# EAGLE design Mouse Version 2 (EAGLE 9.5.1)
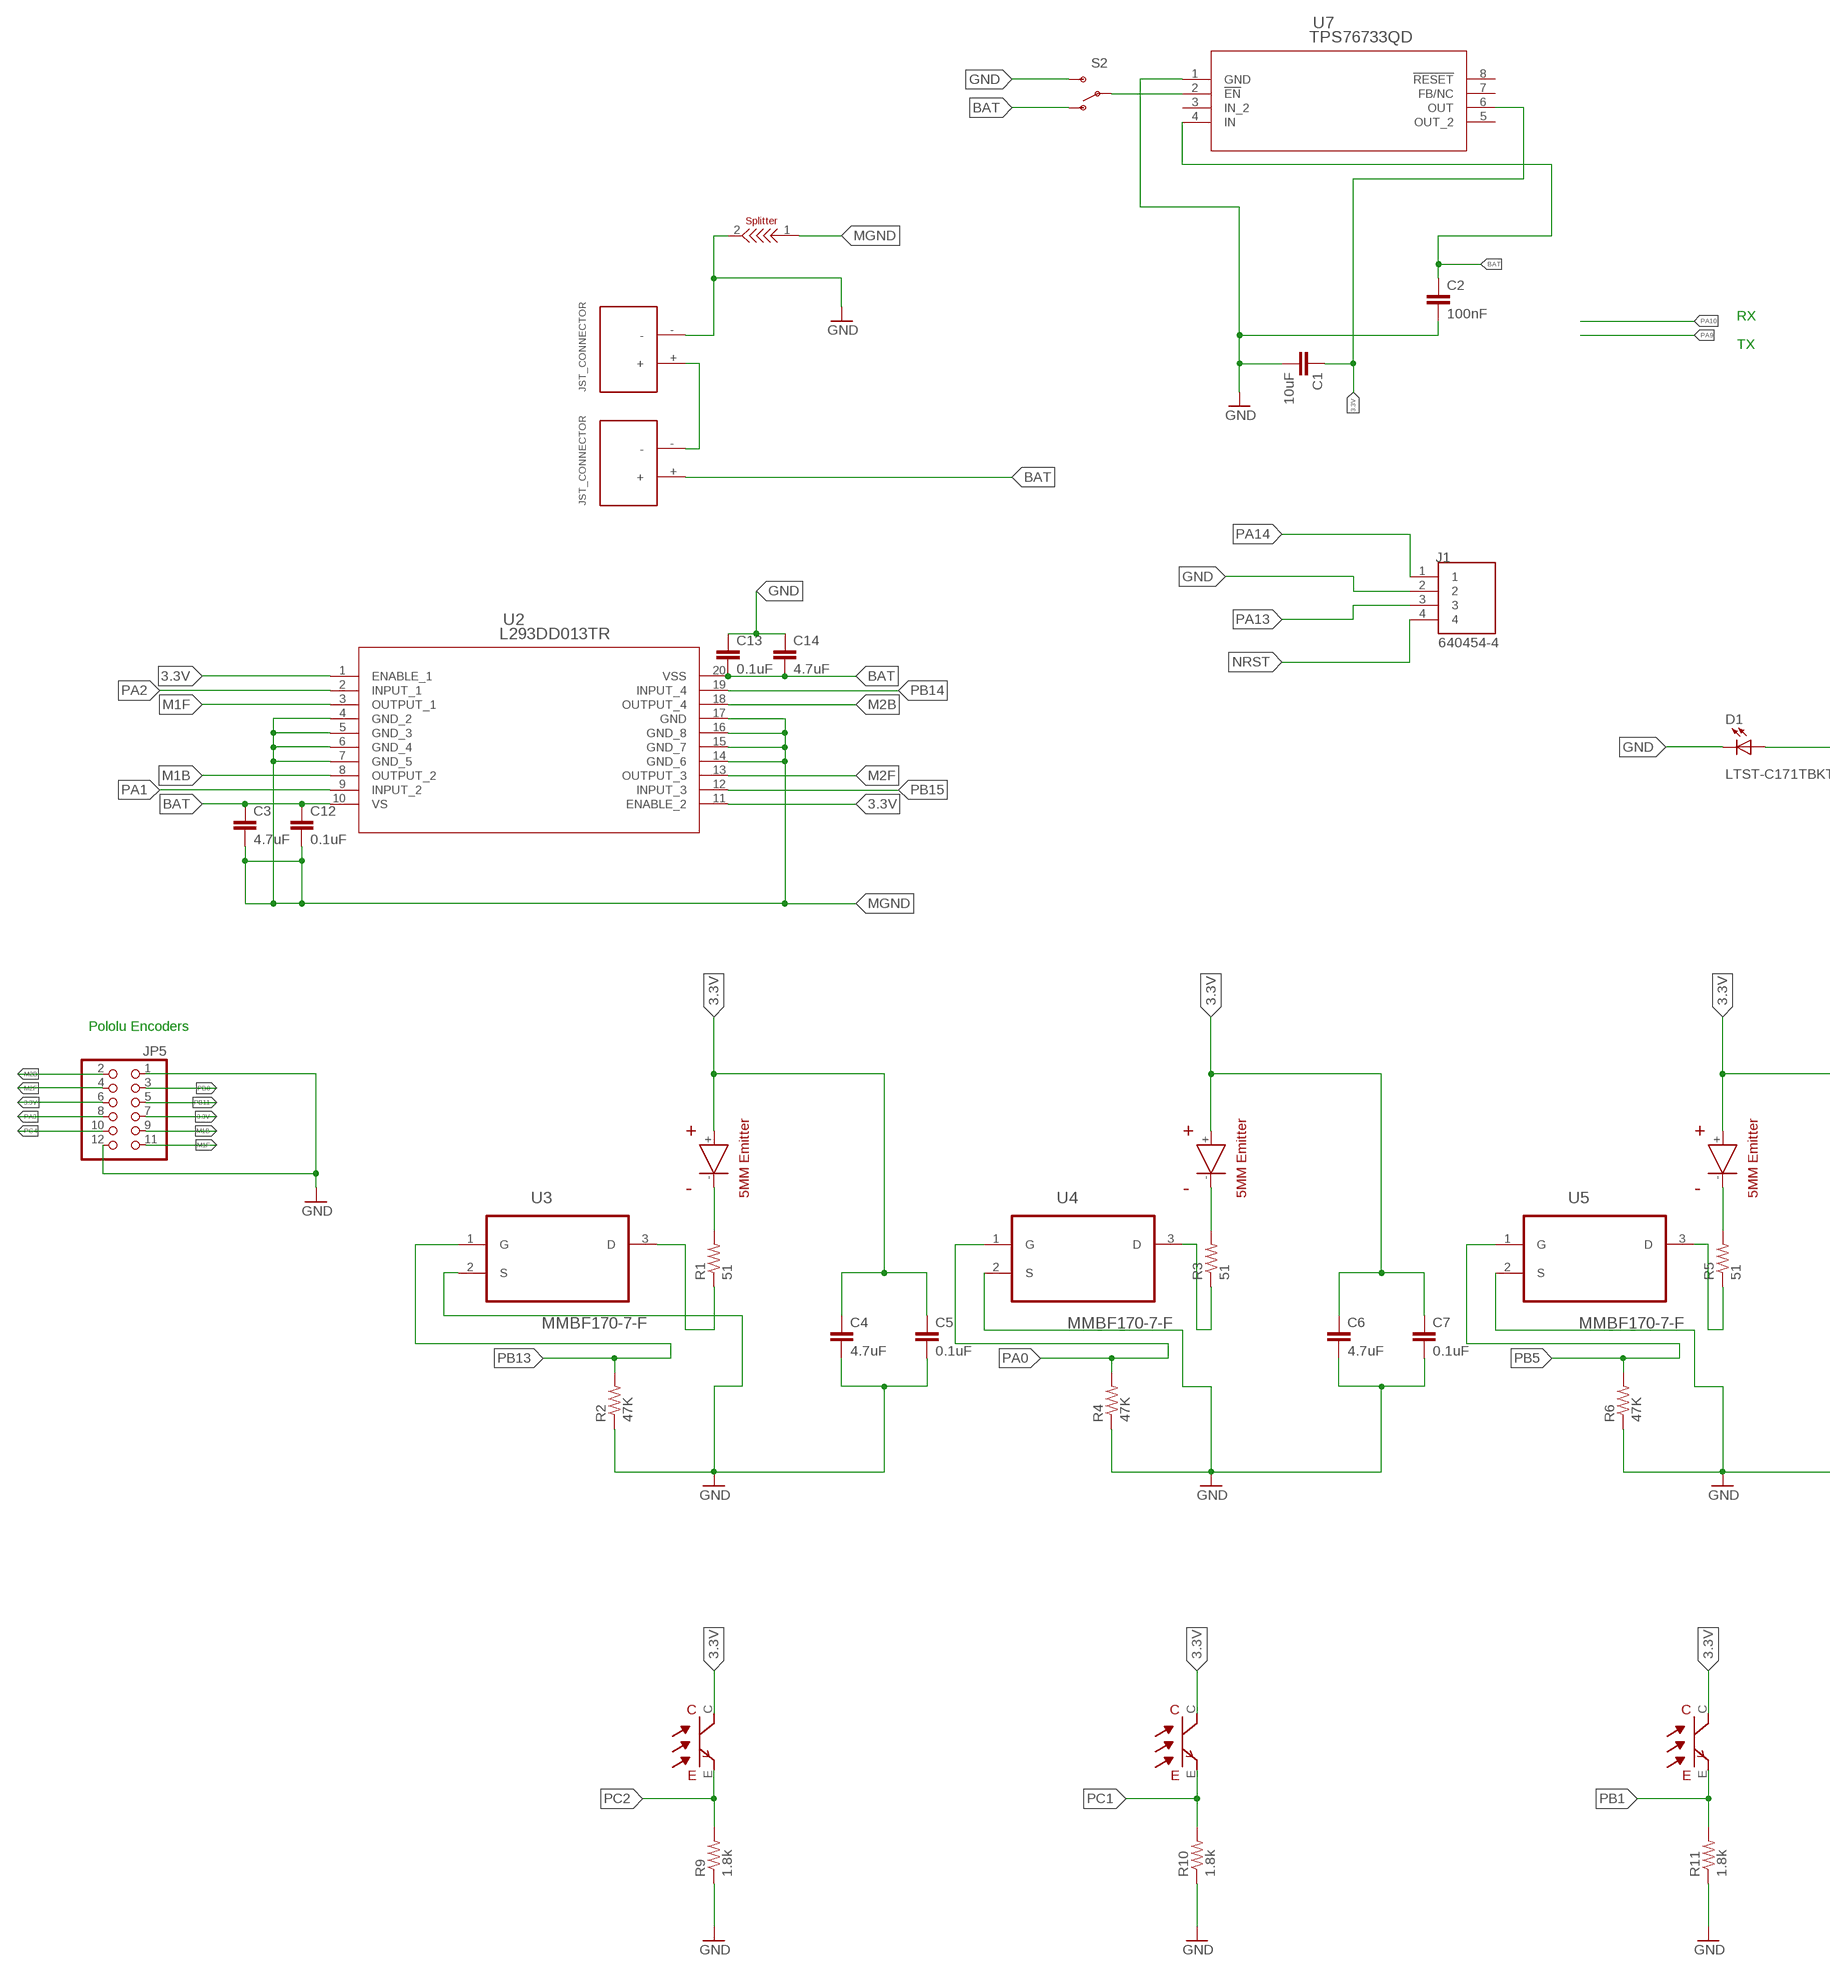
[diagram p0: schematic, sheet 1, part 1 of 2]
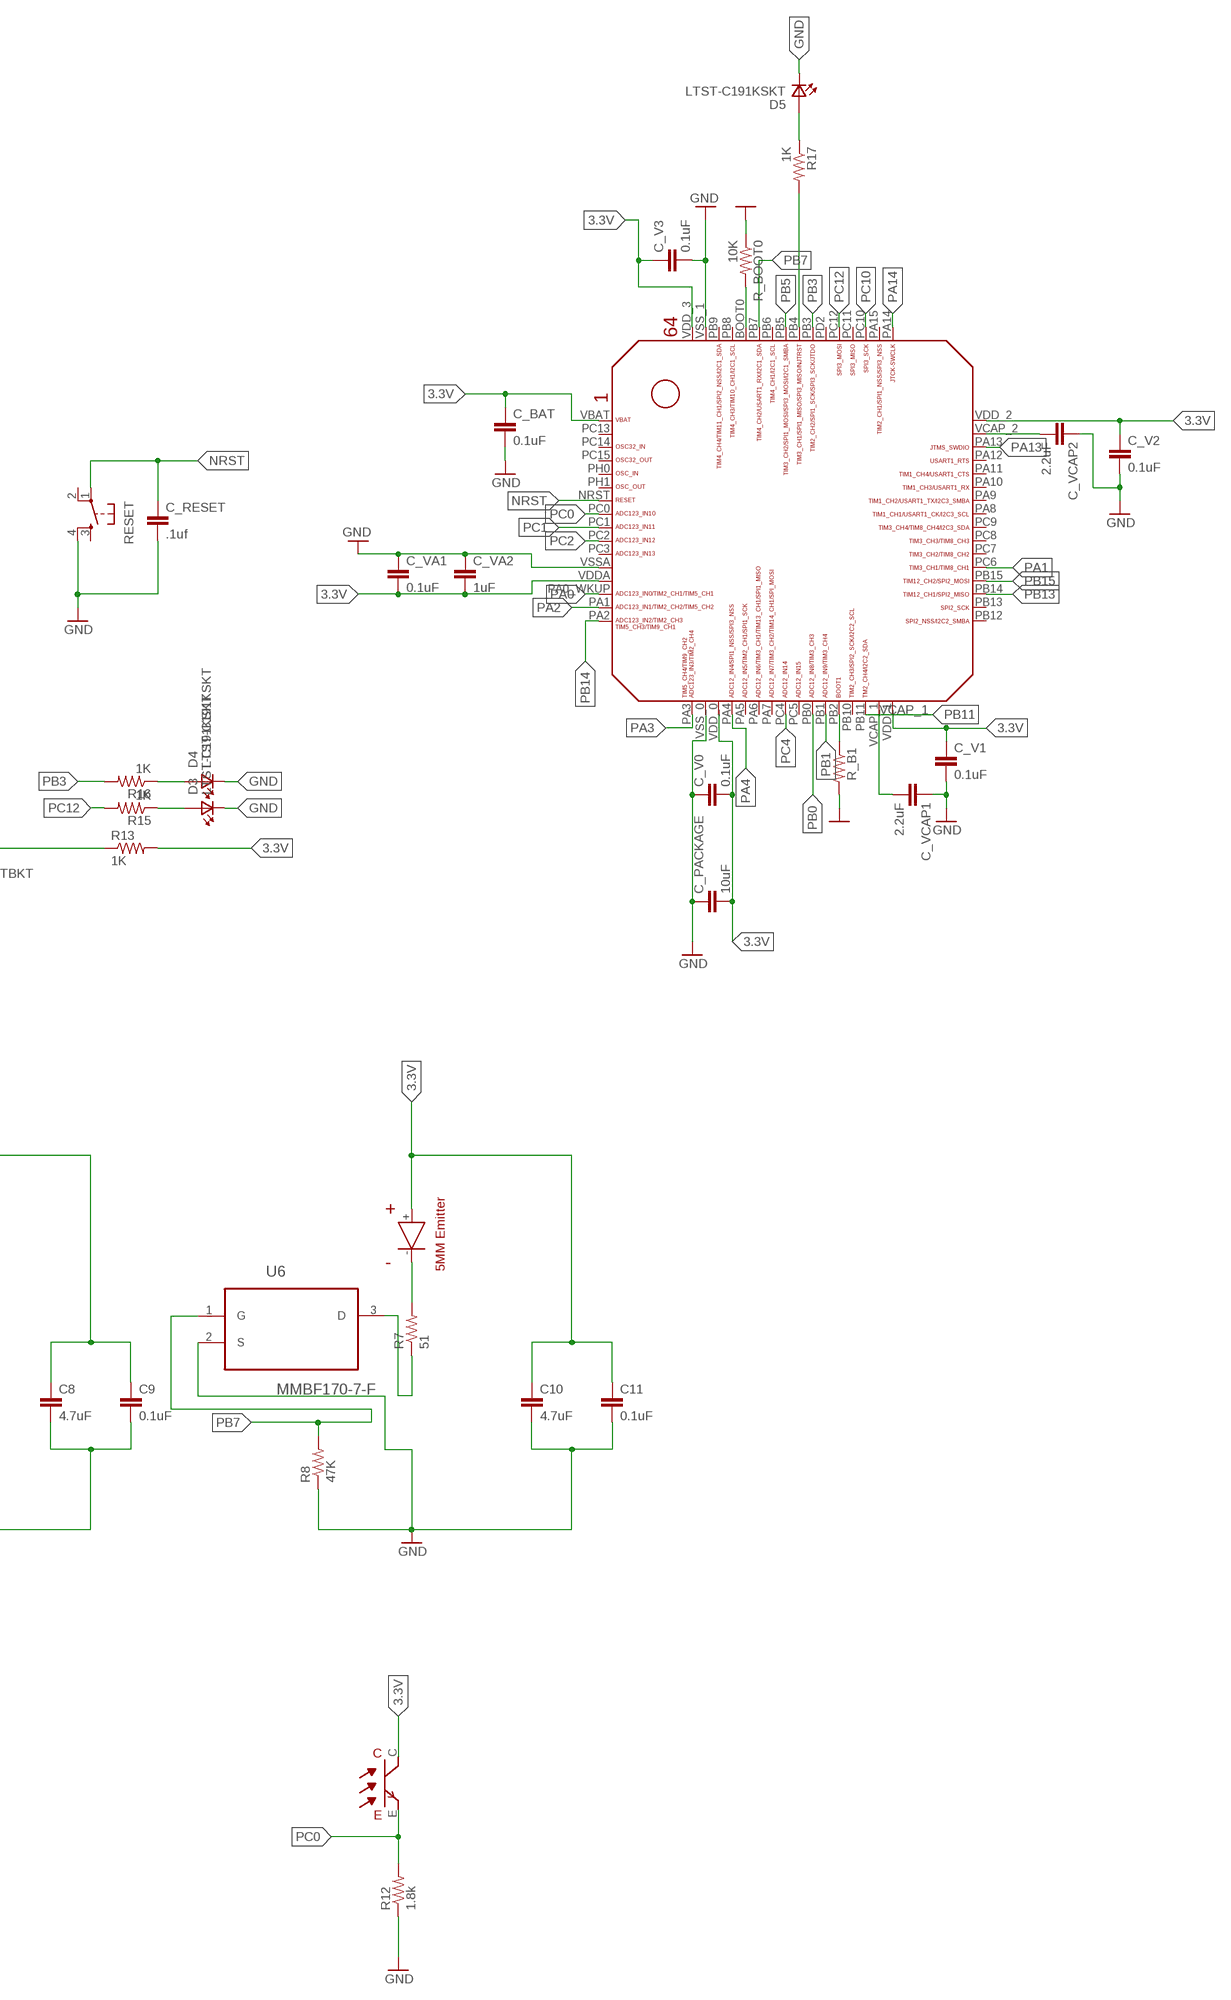
[diagram p1: schematic, sheet 1, part 2 of 2]

## Parts
C1  10uF  CAP0603-CAP  [0603-CAP]
C2  100nF  CAP0603-CAP  [0603-CAP]
C3  4.7uF  CAP0603-CAP  [0603-CAP]
C4  4.7uF  C-EUC1206  [C1206]
C5  0.1uF  C-EUC1206  [C1206]
C6  4.7uF  C-EUC1206  [C1206]
C7  0.1uF  C-EUC1206  [C1206]
C8  4.7uF  C-EUC1206  [C1206]
C9  0.1uF  C-EUC1206  [C1206]
C10  4.7uF  C-EUC1206  [C1206]
C11  0.1uF  C-EUC1206  [C1206]
C12  0.1uF  CAP0603-CAP  [0603-CAP]
C13  0.1uF  CAP0603-CAP  [0603-CAP]
C14  4.7uF  CAP0603-CAP  [0603-CAP]
C_BAT  0.1uF  CAP0603-CAP  [0603-CAP]
C_PACKAGE  10uF  CAP0603-CAP  [0603-CAP]
C_RESET  .1uf  10NF-0603-50V-10%  [0603]
C_V0  0.1uF  CAP0603-CAP  [0603-CAP]
C_V1  0.1uF  CAP0603-CAP  [0603-CAP]
C_V2  0.1uF  CAP0603-CAP  [0603-CAP]
C_V3  0.1uF  CAP0603-CAP  [0603-CAP]
C_VA1  0.1uF  CAP0603-CAP  [0603-CAP]
C_VA2  1uF  CAP0603-CAP  [0603-CAP]
C_VCAP1  2.2uF  CAP0603-CAP  [0603-CAP]
C_VCAP2  2.2uF  CAP0603-CAP  [0603-CAP]
D1  LTST-C171TBKT  [DIOC200X125X110]
D3  LTST-C191KSKT  [0603]
D4  LTST-C191KSKT  [0603]
D5  LTST-C191KSKT  [0603]
J1  640454-4  [TE_640454-4]
JP5  PINHD-2X6  [2X06]
R1  51  R-US_R0603  [R0603]
R2  47K  R-US_R0603  [R0603]
R3  51  R-US_R0603  [R0603]
R4  47K  R-US_R0603  [R0603]
R5  51  R-US_R0603  [R0603]
R6  47K  R-US_R0603  [R0603]
R7  51  R-US_R0603  [R0603]
R8  47K  R-US_R0603  [R0603]
R9  1.8k  R-US_R0603  [R0603]
R10  1.8k  R-US_R0603  [R0603]
R11  1.8k  R-US_R0603  [R0603]
R12  1.8k  R-US_R0603  [R0603]
R13  1K  R-US_R0603  [R0603]
R15  1K  R-US_R0603  [R0603]
R16  1K  R-US_R0603  [R0603]
R17  1K  R-US_R0603  [R0603]
R_B1  10K  RESISTOR0603  [0603-RES]
R_BOOT0  10K  RESISTOR0603  [0603-RES]
RESET  TAC_SWITCHPTH  [TACTILE-PTH]
S2  SWITCH-SPSTPTH  [SWITCH-SPDT]
U2  L293DD013TR  [SO-20]
U3  MMBF170-7-F  [SOT103P240X110-3N]
U4  MMBF170-7-F  [SOT103P240X110-3N]
U5  MMBF170-7-F  [SOT103P240X110-3N]
U6  MMBF170-7-F  [SOT103P240X110-3N]
U7  TPS76733QD  [D8]
U$1  JST_CONNECTOR_FEMALE  [JST_CONNECTOR_FEMALE]
U$2  JST_CONNECTOR_FEMALE  [JST_CONNECTOR_FEMALE]
U$3  SPLITTER  [SPLITTER]
U$4  RECEIVER  [RECEIVER]
U$5  EMITTER  [EMITTER]
U$6  EMITTER  [EMITTER]
U$7  EMITTER  [EMITTER]
U$8  EMITTER  [EMITTER]
U$9  STM32F405/415_LQFP64  [STM32F405/415_LQFP64]
U$15  RECEIVER  [RECEIVER]
U$18  RECEIVER  [RECEIVER]
U$19  RECEIVER  [RECEIVER]

## Nets
3.3V: C1.1 C4.1 C5.1 C6.1 C7.1 C8.1 C9.1 C10.1 C11.1 C_BAT.1 C_PACKAGE.2 C_V0.2 C_V1.1 C_V2.1 C_V3.1 C_VA1.2 C_VA2.2 JP5.6 JP5.7 R13.2 U2.1(ENABLE_1) U2.11(ENABLE_2) U7.6(OUT) U$4.C U$5.+ U$6.+ U$7.+ U$8.+ U$9.VBAT U$9.VDD_0 U$9.VDD_1 U$9.VDD_2 U$9.VDD_3 U$9.VDDA U$15.C U$18.C U$19.C
BAT: C2.1 C3.1 C12.1 C13.2 C14.2 S2.1(O) U2.10(VS) U2.20(VSS) U7.4(IN) U$2.+
BOOT0: R_BOOT0.2 U$9.BOOT0
GND: C1.2 C2.2 C4.2 C5.2 C6.2 C7.2 C8.2 C9.2 C10.2 C11.2 C13.1 C14.1 C_BAT.2 C_PACKAGE.1 C_RESET.2 C_V0.1 C_V1.2 C_V2.2 C_V3.2 C_VA1.1 C_VA2.1 C_VCAP1.1 C_VCAP2.1 D1.- D3.1(K2) D4.1(K2) D5.1(K2) J1.2 JP5.1 JP5.12 R2.1 R4.1 R6.1 R8.1 R9.1 R10.1 R11.1 R12.1 R_B1.2 R_BOOT0.1 RESET.4 S2.3(S) U3.2(S) U4.2(S) U5.2(S) U6.2(S) U7.1(GND) U$1.- U$3.2 U$9.VSS_0 U$9.VSS_1 U$9.VSSA
M1B: JP5.9 U2.8(OUTPUT_2)
M1F: JP5.11 U2.3(OUTPUT_1)
M2B: JP5.2 U2.18(OUTPUT_4)
M2F: JP5.4 U2.13(OUTPUT_3)
MGND: C3.2 C12.2 U2.4(GND_2) U2.5(GND_3) U2.6(GND_4) U2.7(GND_5) U2.14(GND_6) U2.15(GND_7) U2.16(GND_8) U2.17(GND) U$3.1
N$1: U$1.+ U$2.-
N$2: R3.2 U$6.-
N$3: S2.2(P) U7.2(!EN)
N$5: C_VCAP2.2 U$9.VCAP_2
N$6: R1.2 U$5.-
N$7: R1.1 U3.3(D)
N$9: D1.+ R13.1
N$10: R3.1 U4.3(D)
N$11: R5.2 U$7.-
N$12: R5.1 U5.3(D)
N$13: R7.2 U$8.-
N$14: R7.1 U6.3(D)
N$18: D3.2(A2) R15.1
N$20: D4.2(A2) R16.1
N$22: D5.2(A2) R17.1
NRST: C_RESET.1 J1.4 RESET.1 U$9.NRST
PA0: R4.2 U4.1(G) U$9.PA0_WKUP(PA0_AKUP)
PA1: U2.9(INPUT_2) U$9.PC6
PA2: U2.2(INPUT_1) U$9.PA1
PA3: JP5.8 U$9.PA3
PA4: U$9.PA4
PA13: J1.3 U$9.PA13
PA14: J1.1 U$9.PA14
PB0: JP5.3 U$9.PB0
PB1: R11.2 U$9.PB1 U$15.E
PB2: R_B1.1 U$9.PB2
PB3: R16.2 U$9.PB3
PB4: R17.2 U$9.PB4
PB5: R6.2 U5.1(G) U$9.PB5
PB7: R8.2 U6.1(G) U$9.PB7
PB11: JP5.5 U$9.PB11
PB13: R2.2 U3.1(G) U$9.PB14
PB14: U2.19(INPUT_4) U$9.PA2
PB15: U2.12(INPUT_3) U$9.PB15
PC0: R12.2 U$4.E U$9.PC0
PC1: R10.2 U$9.PC1 U$18.E
PC2: R9.2 U$9.PC2 U$19.E
PC4: JP5.10 U$9.PC4
PC10: U$9.PC10
PC12: R15.2 U$9.PC12
VCAP_1: C_VCAP1.2 U$9.VCAP_1
Unconnected: RESET.2 RESET.3 U7.3(IN_2) U7.5(OUT_2) U7.7(FB/NC) U7.8(!RESET) U$9.PA5 U$9.PA6 U$9.PA7 U$9.PA8 U$9.PA9 U$9.PA10 U$9.PA11 U$9.PA12 U$9.PA15 U$9.PB6 U$9.PB8 U$9.PB9 U$9.PB10 U$9.PB12 U$9.PB13 U$9.PC3 U$9.PC5 U$9.PC7 U$9.PC8 U$9.PC9 U$9.PC11 U$9.PC13 U$9.PC14 U$9.PC15 U$9.PD2 U$9.PH0 U$9.PH1

## Notes on the sheet
- RX
- TX
- Pololu Encoders

## Library data of the parts
C1-C3 C12-C14 C_BAT C_PACKAGE C_V0 C_V1-C_V3 C_VA1 C_VA2 C_VCAP1 C_VCAP2 = SparkFun:CAP: Capacitor Standard 0603 ceramic capacitor, and 0.1" leaded capacitor.
C4-C11 = rcl:C-EU: CAPACITOR, European symbol; SPICEPREFIX: C
C_RESET = SparkFun-Capacitors:10NF: 0.01uF/10nF/10,000pF ceramic capacitors A capacitor is a passive two-terminal electrical component used to store electrical energy temporarily in an electric field. CAP-09321; PROD_ID: CAP-00867; VALUE: 10nF
D1 = LTST-C171TBKT:LTST-C171TBKT: Green 2 x 1.25 x 1.1 mm 130° Water Clear 35 mcd 2 V Surface Mount LED; DESCRIPTION: Blue 470nm LED Indication - Discrete 3.3V 0805 _2012 Metric_; DIGI-KEY_PART_NUMBER: 160-1645-1-ND; DIGI-KEY_PURCHASE_URL: https://www.digikey.com/product-detail/en/lite-on-inc/LTST-C171TBKT/160-1645-1-ND/573585?utm_source=snapeda&utm_medium=aggregator&utm_campaign=symbol; MF: Lite-On Inc.; MP: LTST-C171TBKT; PACKAGE: 0805 Lite-On
D3-D5 = LTST-C191KSKT:LTST-C191KSKT: http://octopart.com/ltst-c190krkt-lite-on-549893; DESCRIPTION: Yellow 591nm LED Indication - Discrete 2.1V 0603 _1608 Metric_; DIGI-KEY_PART_NUMBER: 160-1448-1-ND; DIGI-KEY_PURCHASE_URL: https://www.digikey.com/product-detail/en/lite-on-inc/LTST-C191KSKT/160-1448-1-ND/386838?utm_source=snapeda&utm_medium=aggregator&utm_campaign=symbol; MF: Lite-On Inc.; MP: LTST-C191KSKT; PACKAGE: 0603 Lite-On
J1 = 640454-4:640454-4; CENTERLINE_PITCH: 2.54 mm[.1 in]; COMMENT: 640454-4; DESCRIPTION: 04P MTA100 HDR ASSY SQ STR POL; DIGI-KEY_PART_NUMBER: A19431-ND; DIGI-KEY_PURCHASE_URL: https://www.digikey.com/product-detail/en/te-connectivity-amp-connectors/640454-4/A19431-ND/258986?utm_source=snapeda&utm_medium=aggregator&utm_campaign=symbol; EU_ROHS_COMPLIANCE: Compliant; MF: TE Connectivity; MP: 640454-4; NUMBER_OF_POSITIONS: 4; PACKAGE: None; PRODUCT_TYPE: Connector; TE_PURCHASE_URL: https://www.te.com/usa-en/product-640454-4.html?te_bu=Cor&te_type=disp&te_campaign=seda_glo_cor-seda-global-disp-prtnr-fy19-seda-model-bom-cta_sma-317_1&elqCampaignId=32493
JP5 = pinhead:PINHD-2X6: PIN HEADER
R1-R13 R15-R17 = MM2019Libv3:R-US_: RESISTOR, American symbol; SPICEPREFIX: R
R_B1 R_BOOT0 = SparkFun-Resistors:RESISTOR: Resistor Basic schematic elements and footprints for 0603, 1206, and PTH resistors.
RESET = SparkFun-Retired:TAC_SWITCH: Momentary Switch Button commonly used for reset or general input. Spark Fun Electronics SKU : COM-00097 SMT- SWCH-08247
S2 = SparkFun:SWITCH-SPST: SPST Switch Simple slide switch. Spark Fun Electronics SKU : COM-00102
U2 = MM2019Libv3:L293DD013TR; BUILT_BY: EMA_UL_Team; MANUFACTURER_PART_NUMBER: L293DD013TR; VENDOR: STMicroelectronics
U3-U6 = MMBF170-7-F:MMBF170-7-F: N-CHANNEL ENHANCEMENT MODE FIELD EFFECT TRANSISTOR; AVAILABILITY: Unavailable; DESCRIPTION: N-Channel 60V 500mA _Ta_ 300mW _Ta_ Surface Mount SOT-23-3; MF: Diodes Inc.; MP: MMBF170-7-F; PACKAGE: SOT-23-3 Diodes Inc.; PRICE: None
U7 = QFN50P300X300X80-17N:TPS76733QD; BUILT_BY: EMA_UL_Team; MANUFACTURER_PART_NUMBER: TPS76733QD; VENDOR: Texas Instruments
U$1 U$2 = JST_CONNECTOR_FEMALE. through hole:JST_CONNECTOR_FEMALE
U$3 = splitter:SPLITTER
U$4 U$15 U$18 U$19 = sfh4550 _ teft4300:RECEIVER
U$5-U$8 = sfh4550 & teft4300:EMITTER
U$9 = STM32F10x F4xx:STM32F405/415_LQFP64

## Board
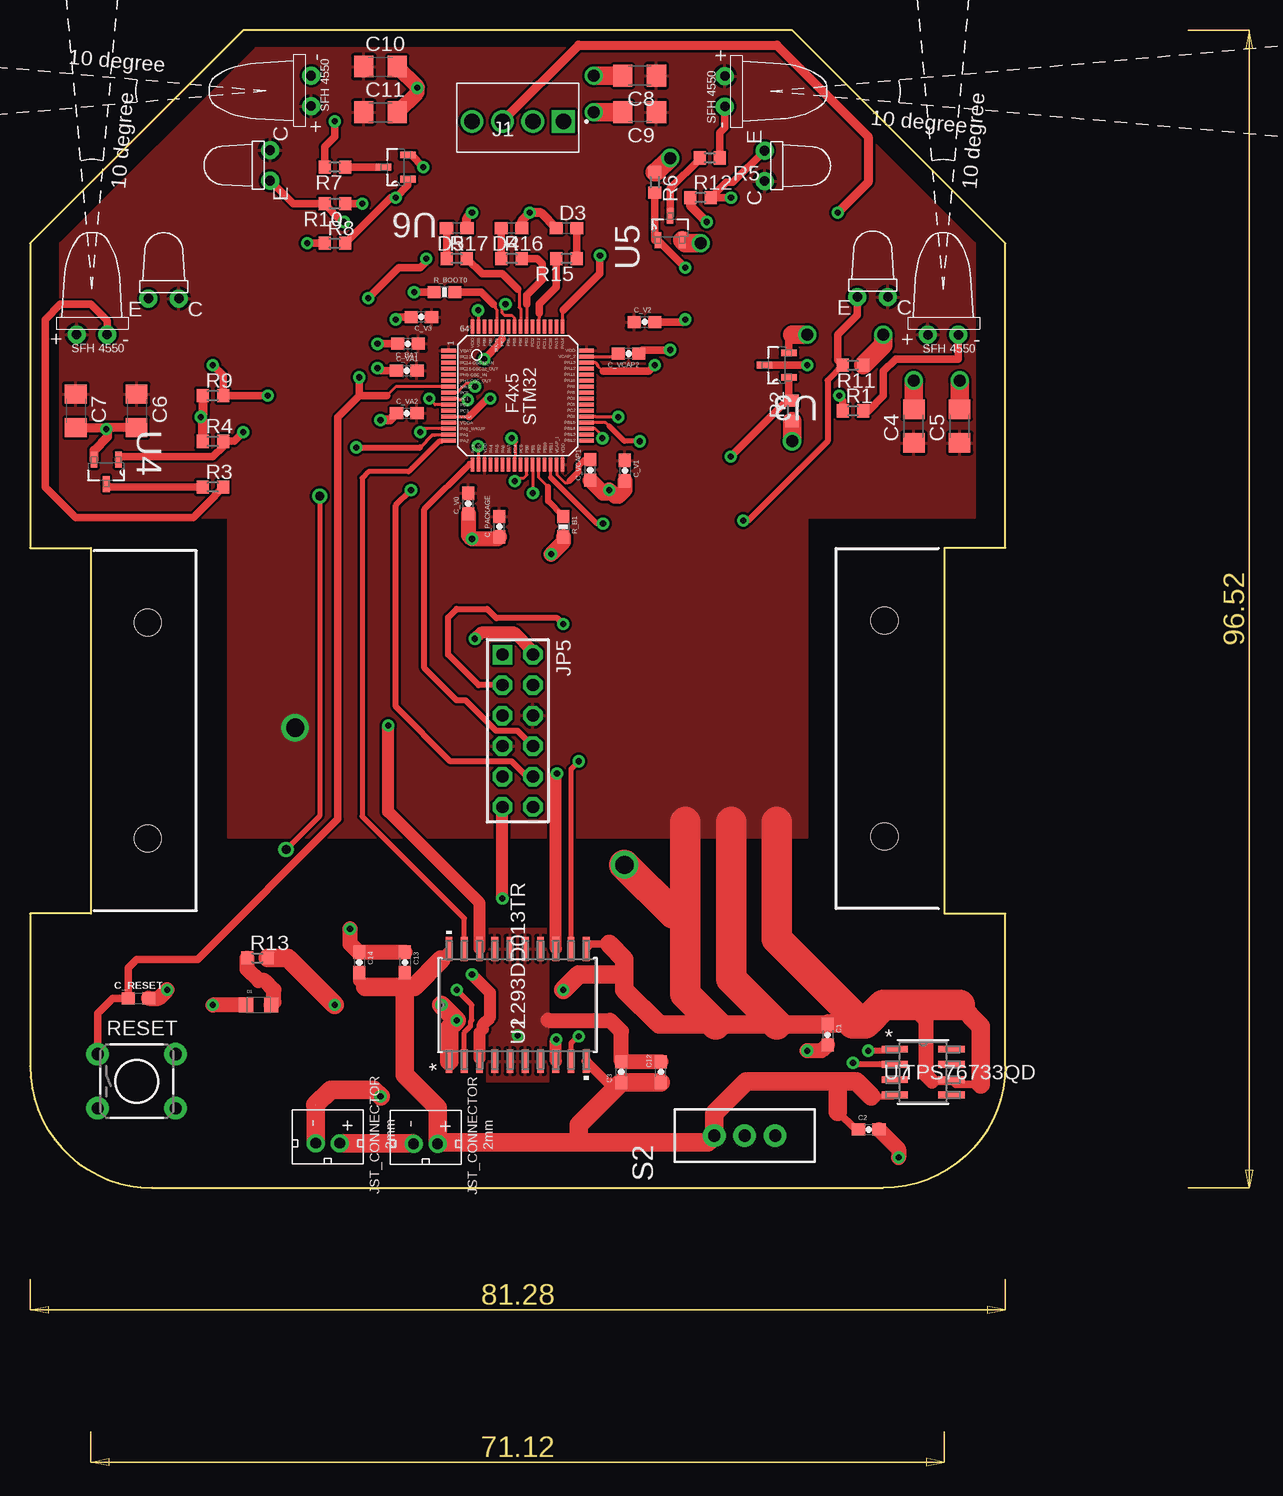
[diagram p2: board, top side]
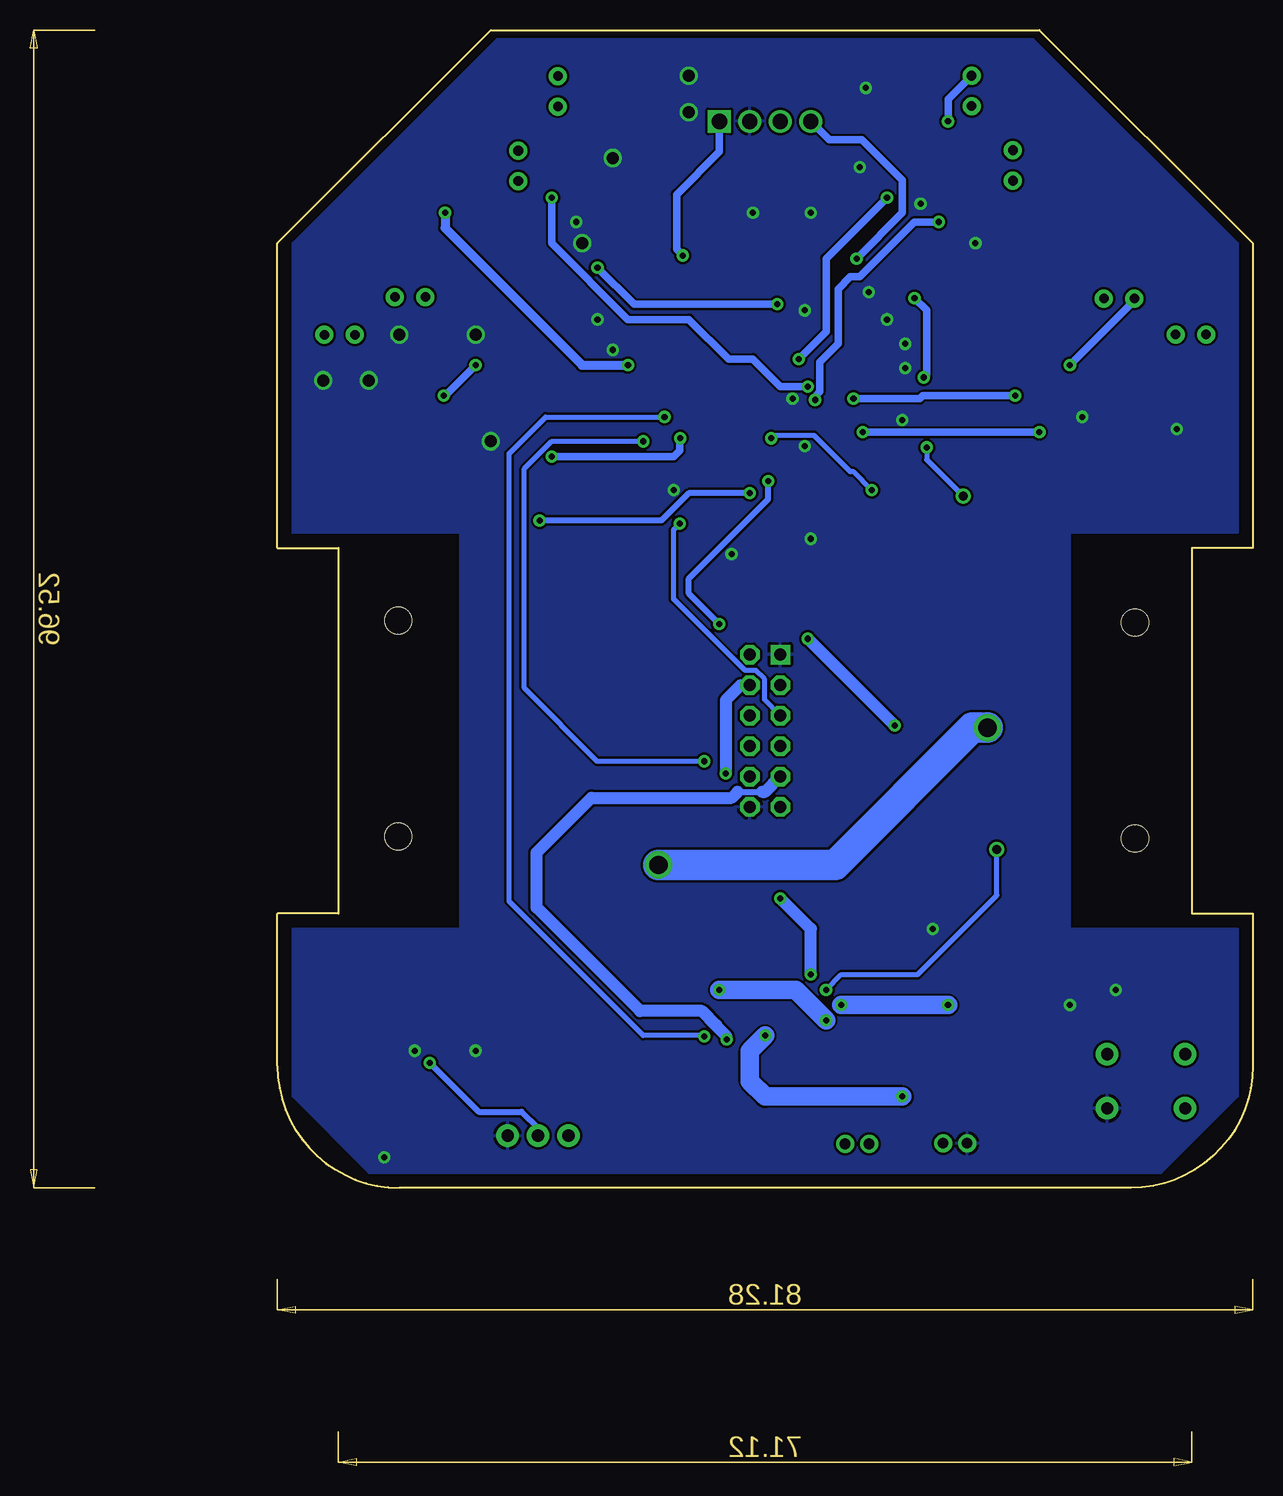
[diagram p3: board, bottom side, seen from below]

Size 81.28 x 96.52 mm. Coordinates in mm from the lower left corner, seen from the top.
Outline: 10.16,0 71.12,0 arc90 81.28,10.16 81.28,22.86 76.2,22.86 76.2,53.34 81.28,53.34 81.28,78.74 63.5,96.52 17.78,96.52 0,78.74 0,53.34 5.08,53.34 5.08,22.86 0,22.86 0,10.16 arc90 10.16,0
Copper layers (1*16): Top 0.035mm / dielectric 1.5mm / Bottom 0.035mm
Design rules "SparkFun *": minimum track width 8mil, minimum drill 20mil, track to track 8mil, track to pad 8mil, pad to pad 7mil, via to via 8mil, smd to smd 7mil, copper to edge 10mil, drill to drill 8mil, minimum pad ring 12mil, minimum via ring 10mil, stop-mask expansion 4mil, vias tented up to drill 25mil, thermal gap 10mil
Holes 2.25 mm at 9.81,29.12 9.81,47.12 71.21,29.29 71.21,47.29
bKeepout: area 5.3,23.1 to 13.8,53.1; area 67.2,23.3 to 75.7,53.3
tRestrict: area 5.3,23.1 to 13.8,53.1; area 67.2,23.3 to 75.7,53.3
bRestrict: area 5.3,23.1 to 13.8,53.1; area 67.2,23.3 to 75.7,53.3

### Footprints (pad centres in the part's own frame; a part is rotated, then mirrored left to right if it is on the bottom)
0603-CAP = smd 1.1 x 1: 1 -0.85,0; 2 0.85,0
C1206 = smd 1.6 x 1.8: 1 -1.4,0; 2 1.4,0
0603 = smd 1.1 x 1: 1 -0.85,0; 2 0.85,0
DIOC200X125X110 = smd 1.2 x 1.2: + 1.05,0; - -1.05,0
TE_640454-4 = drill 1.27 pad 1.62 square: 1 0,0 | drill 1.27 pad 1.62: 2 2.54,0; 3 5.08,0; 4 7.62,0
2X06 = drill 1.016 square: 1 -6.35,-1.27 | drill 1.016 octagon: 2 -6.35,1.27; 3 -3.81,-1.27; 4 -3.81,1.27; 5 -1.27,-1.27; 6 -1.27,1.27; 7 1.27,-1.27; 8 1.27,1.27; 9 3.81,-1.27; 10 3.81,1.27; 11 6.35,-1.27; 12 6.35,1.27
R0603 = smd 1 x 1.1: 1 -0.85,0; 2 0.85,0
0603-RES = smd 1.1 x 1: 1 -0.85,0; 2 0.85,0
TACTILE-PTH = drill 1.016 pad 1.88: 1 -3.251,2.261; 2 3.251,2.261; 3 -3.251,-2.261; 4 3.251,-2.261
SWITCH-SPDT = drill 1.016 pad 1.88: 1 0,2.54; 2 0,0; 3 0,-2.54
SO-20 = smd 1.981 x 0.559: 1 -4.686,5.715; 2 -4.686,4.445; 3 -4.686,3.175; 4 -4.686,1.905; 5 -4.686,0.635; 6 -4.686,-0.635; 7 -4.686,-1.905; 8 -4.686,-3.175; 9 -4.686,-4.445; 10 -4.686,-5.715; 11 4.686,-5.715; 12 4.686,-4.445; 13 4.686,-3.175; 14 4.686,-1.905; 15 4.686,-0.635; 16 4.686,0.635; 17 4.686,1.905; 18 4.686,3.175; 19 4.686,4.445; 20 4.686,5.715
SOT103P240X110-3N = smd 1.321 x 0.559: 1 -1.016,1.016; 2 -1.016,-1.016; 3 1.016,0
D8 = smd 2.184 x 0.559: 1 -2.362,1.905; 2 -2.362,0.635; 3 -2.362,-0.635; 4 -2.362,-1.905; 5 2.362,-1.905; 6 2.362,-0.635; 7 2.362,0.635; 8 2.362,1.905
JST_CONNECTOR_FEMALE = drill 0.889: + 0,1; - 0,-1
SPLITTER = smd 0.102 x 0.102: 1 0,0; 2 0,0
RECEIVER = drill 0.8 pad 1.5: C 1.27,-0.5; E -1.27,-0.5
EMITTER = drill 0.8 pad 1.5: + -1.27,-0.5; - 1.27,-0.5
STM32F405/415_LQFP64 = smd 1.2 x 0.3: BOOT0 -5.75,-1.75; PA3 5.75,-3.75; PA4 5.75,-2.25; PA5 5.75,-1.75; PA6 5.75,-1.25; PA7 5.75,-0.75; PA14 -5.75,3.75; PA15 -5.75,3.25; PB0 5.75,0.75; PB1 5.75,1.25; PB2 5.75,1.75; PB3 -5.75,0.75; PB4 -5.75,0.25; PB5 -5.75,-0.25; PB6 -5.75,-0.75; PB7 -5.75,-1.25; PB8 -5.75,-2.25; PB9 -5.75,-2.75; PB10 5.75,2.25; PB11 5.75,2.75; PC4 5.75,-0.25; PC5 5.75,0.25; PC10 -5.75,2.75; PC11 -5.75,2.25; PC12 -5.75,1.75; PD2 -5.75,1.25; VCAP_1 5.75,3.25; VDD_0 5.75,-2.75; VDD_1 5.75,3.75; VDD_3 -5.75,-3.75; VSS_0 5.75,-3.25; VSS_1 -5.75,-3.25 | smd 0.3 x 1.2: NRST -0.75,-5.75; PA0_WKUP 2.75,-5.75; PA1 3.25,-5.75; PA2 3.75,-5.75; PA8 -0.25,5.75; PA9 -0.75,5.75; PA10 -1.25,5.75; PA11 -1.75,5.75; PA12 -2.25,5.75; PA13 -2.75,5.75; PB12 3.75,5.75; PB13 3.25,5.75; PB14 2.75,5.75; PB15 2.25,5.75; PC0 -0.25,-5.75; PC1 0.25,-5.75; PC2 0.75,-5.75; PC3 1.25,-5.75; PC6 1.75,5.75; PC7 1.25,5.75; PC8 0.75,5.75; PC9 0.25,5.75; PC13 -3.25,-5.75; PC14 -2.75,-5.75; PC15 -2.25,-5.75; PH0 -1.75,-5.75; PH1 -1.25,-5.75; VBAT -3.75,-5.75; VCAP_2 -3.25,5.75; VDD_2 -3.75,5.75; VDDA 2.25,-5.75; VSSA 1.75,-5.75

### Placement (x,y rotation side)
C1  66.47,12.77 270 top
C2  69.9,4.86 0 top
C3  49.28,9.65 90 top
C4  73.66,63.5 90 top
C5  77.47,63.5 90 top
C6  8.89,64.77 270 top
C7  3.81,64.77 270 top
C8  50.8,92.71 180 top
C9  50.8,89.66 180 top
C10  29.21,93.47 0 top
C11  29.21,89.66 0 top
C12  52.58,9.65 90 top
C13  31.24,18.8 270 top
C14  27.43,18.8 270 top
C_BAT  31.5,70.36 180 top
C_PACKAGE  39.12,55.12 90 top
C_RESET  9.04,15.8 0 top
C_V0  36.53,57.05 90 top
C_V1  49.58,59.79 270 top
C_V2  51.21,72.19 0 top
C_V3  32.61,72.59 180 top
C_VA1  31.4,68.12 0 top
C_VA2  31.4,64.57 0 top
C_VCAP1  46.69,59.85 90 top
C_VCAP2  49.88,69.55 180 top
D1  19.05,15.24 0 top
D3  44.7,80.01 0 top
D4  40.13,80.01 180 top
D5  35.56,80.01 180 top
J1  44.45,88.9 180 top
JP5  40.64,38.1 270 top
R1  68.58,64.77 0 top
R2  63.5,64.77 90 top
R3  15.24,58.42 0 top
R4  15.24,62.23 0 top
R5  56.64,85.85 0 top
R6  52.07,83.82 270 top
R7  25.4,85.09 180 top
R8  25.4,78.74 0 top
R9  15.24,66.04 0 top
R10  25.4,82.04 180 top
R11  68.58,68.58 180 top
R12  55.88,82.55 0 top
R13  18.95,19.16 0 top
R15  44.7,77.47 180 top
R16  40.13,77.47 0 top
R17  35.56,77.47 0 top
R_B1  44.45,55.12 270 top
R_BOOT0  34.54,74.68 0 top
RESET  8.89,8.89 0 top
S2  59.56,4.35 90 top
U2  40.64,15.24 90 top
U3  62.23,68.58 180 top
U4  6.35,59.69 270 top
U5  53.34,80.01 90 top
U6  30.48,85.09 180 top
U7  74.42,9.65 0 top
U$1  24.81,3.72 270 top
U$2  32.97,3.66 270 top
U$3  23.78,6.91 0 top
U$4  61.71,85.19 270 top
U$5  76.09,71.61 0 top
U$6  5.16,71.64 0 top
U$7  58.41,91.41 270 top
U$8  22.93,91.44 90 top
U$9  40.64,66.04 270 top
U$15  70.22,74.77 0 top
U$18  19.5,85.23 90 top
U$19  11.14,74.63 0 top

### Tracks (layer width: path | path; a pad name or v marks a point on that pad's centre or on a via)
3.3V  (via drill 0.51, 1.52)
  Top 0.61: 48.26,20.32 46.75,20.32 U2.11 | 79.25,8.64 77.17,8.64 U7.6 76.66,8.89 75.18,8.89
  Top 1.27: 75.18,8.89 74.68,9.4 74.68,13.97 73.41,15.24 71.12,15.24
  Top 1.524: 69.26,13.72 68.58,13.72 66.56,13.72 C1.1 62.23,13.62 57.15,13.62 52.42,13.62 49.53,16.51 49.53,17.78 | 49.53,17.78 49.53,19.05 48.26,20.32 | U2.1 34.92,13.34 v35.56,13.97 v34.29,15.24 | v44.45,16.51 45.72,17.78 49.53,17.78 | v25.4,15.24 21.48,19.16 R13.2 | 77.47,15.24 79.25,13.46 79.25,8.64
  Top 2.54: 69.26,13.72 62.23,20.74 62.23,30.48 | 62.23,13.62 58.42,17.43 58.42,30.48 | 57.15,13.62 54.61,16.16 54.61,22.86 | 54.61,30.48 54.61,22.86 | 54.61,22.86 53.59,22.86 v49.53,26.92 | 68.58,13.72 69.6,13.72 71.12,15.24 77.47,15.24
  Bottom 1.524: v35.56,13.97 38.1,16.51 v44.45,16.51 | v34.29,15.24 v25.4,15.24
  Bottom 2.54: v49.53,26.92 34.8,26.92 23.37,38.35 v22.1,38.35
  pour Top: 2.54,78.74 2.54,55.88 16.51,55.88 16.51,29.21 64.77,29.21 64.77,55.88 78.74,55.88 78.74,78.74 62.48,95 18.8,95
BAT
  Top 0.508: 70.1,7.62 71.93,7.62 U7.4
  Top 0.61: 68.58,8.89 68.75,8.89 | C13.2 31.24,16.76 | 67.31,6.35 68.8,4.86 C2.1 | 34.29,19.29 U2.20 34.92,19.68 34.29,19.05 34.29,19.29
  Top 0.813: U2.10 48.11,8.8 C3.1
  Top 1.016: 27.94,16.76 27.43,17.27 C14.2
  Top 1.524: 45.72,3.81 34.12,3.81 U$2.+ 33.97,6.67 31.24,9.4 31.24,16.76 | 45.72,3.81 56.48,3.81 S2.1 57.02,6.22 59.69,8.89 67.31,8.89 | 45.72,3.81 45.72,5.25 C3.1 C12.1 | 67.31,8.89 68.58,8.89 | 67.31,8.89 67.31,6.35 | 31.24,16.76 27.94,16.76 | 31.24,16.76 32,16.76 34.29,19.05 | 68.75,8.89 68.83,8.89 70.1,7.62
BOOT0
  Top 0.254: 38.61,73.66 38.79,73.48 38.79,73.31 38.89,73.21 U$9.BOOT0
  Top 0.61: R_BOOT0.2 37.59,74.68 38.61,73.66
GND  (via drill 0.51, 1)
  Top 0.254: U$9.VSS_0 37.39,61.77 v37.34,61.82 | U$9.VSSA 36.6,64.29 | U$9.VSS_1 37.39,73.1 v37.34,73.15
  Top 0.508: U7.1 71.93,11.43 v69.85,11.43
  Top 0.61: U3.2 63.25,70.87 63.5,71.12 | C_VCAP2.1 51.04,69.85 v53.34,69.85 | v54.61,72.39 54.41,72.19 C_V2.2 | v32.77,85.09 31.75,86.11 U6.2 | R10.1 v27.69,82.04 | R8.1 v23.11,78.74 | R_BOOT0.1 v32,74.68 | v30.48,72.39 30.68,72.59 C_V3.2 | C_BAT.2 v28.96,70.36 | C_VA1.1 29.16,68.12 v28.96,68.33 | v38.35,65.79 38.1,65.79 36.6,64.29
  Top 0.762: D5.1 36.41,80.86 v36.83,81.28 | D4.1 40.98,80.61 v41.66,81.28 42.58,81.28 D3.1 | R9.1 14.39,64.43 | 14.39,64.43 v14.22,64.26 | R4.1 14.39,64.43 | C6.2 6.47,63.37 | 6.47,63.37 v6.35,63.25 | C7.2 6.47,63.37 | U4.2 5.33,61.47 6.47,62.61 6.47,63.37 | C_VA2.1 29.99,64.01 v29.21,64.01 | R12.1 55.03,81.88 v56.39,80.52
  Top 1.27: D1.- v15.24,15.24 | C2.2 72.39,3.21 v72.39,2.54 | C_RESET.2 10.72,15.8 v11.43,16.51 | v26.67,21.59 26.67,20.32 27.34,19.65 C14.1 C13.1 | C1.2 65.98,11.43 v64.77,11.43 | C_V0.1 36.53,54.41 v36.83,54.1 38.95,54.1 C_PACKAGE.1 | C_VCAP1.1 47.77,57.91 48.01,57.91 v48.26,58.17 48.77,57.66 49.06,57.66 49.58,58.18 C_V1.2 | v43.43,52.83 44.45,53.85 R_B1.2 | C10.2 32.26,91.82 v32.26,91.69 32.26,91.31 C11.2
  Top 1.524: C4.2 v73.66,67.31 | R2.1 v63.5,62.23 | v77.47,67.31 C5.2 | R11.1 71.12,70.27 v71.12,71.12 | 63.5,71.12 v64.77,71.12 | C8.2 v46.99,92.71 | C9.2 v46.99,89.66 | v53.34,85.85 52.16,84.67 R6.1 | U5.2 54.61,78.74 v55.88,78.74 | U$3.2 23.81,6.88 U$1.-
  pour Bottom: 7.62,1.27 1.27,7.62 1.27,21.59 15.24,21.59 15.24,54.61 1.27,54.61 1.27,78.74 18.29,95.76 62.99,95.76 80.01,78.74 80.01,54.61 66.04,54.61 66.04,21.59 80.01,21.59 80.01,7.62 73.66,1.27
M1B  (via drill 0.51)
  Top 1.016: U2.8 43.81,12.34 v43.84,12.37
  Bottom 0.508: 42.93,33.02 40.89,33.02
  Bottom 0.61: 44.7,13.48 44.7,13.55
  Bottom 1.016: 44.7,13.48 43.84,12.62 v43.84,12.37 | 44.7,13.55 45.88,14.73 51.05,14.73 59.69,23.37 59.69,27.94 55.12,32.51 43.43,32.51 42.93,33.02 | 40.89,33.02 40.64,33.02 JP5.9
M1F  (via drill 0.51)
  Top 0.406: U2.3 37.47,10.79
  Top 1.016: 37.47,10.79 37.47,12.93 37.74,13.21 37.74,13.61 38.35,14.22 38.35,16.26 v36.83,17.78 | v39.37,24.13 JP5.11
  Bottom 1.016: v39.37,24.13 36.83,21.59 v36.83,17.78
M2B  (via drill 0.51)
  Top 0.61: JP5.2 41.91,44.76
  Top 1.016: U2.18 37.47,23.74 29.84,31.36 v29.84,38.54 | v37.08,45.77 37.59,46.28 40.39,46.28 41.91,44.76
  Bottom 1.016: v37.08,45.77 v29.84,38.54
M2F  (via drill 0.51)
  Top 0.61: 43.81,34.44 v43.92,34.54
  Top 1.016: U2.13 43.81,34.44
  Bottom 1.016: v43.92,34.54 43.92,40.66 42.67,41.91 JP5.4
MGND  (via drill 0.51)
  Top 1.27: 43.18,13.97 48.35,13.97 49.28,13.04 C3.2 C12.2
  Top 1.524: v29.21,7.62 28.65,8.18 25.05,8.18 U$3.1
  Bottom 1.524: v29.21,7.62 40.64,7.62 41.91,8.89 41.91,11.43 v40.64,12.7
  pour Top: 43.18,8.89 38.1,8.89 38.1,21.59 43.18,21.59
N$1
  Top 1.524: U$1.+ 31.91,3.72 U$2.-
N$2
  Top 0.61: R3.2 15.4,57.73 15.4,57.66 13.62,55.88 3.81,55.88 1.27,58.42 1.27,72.39 2.54,73.66 5.08,73.66 6.43,72.31 U$6.-
N$3  (via drill 0.51)
  Top 0.508: U7.2 68.71,10.29 v68.58,10.41
  Bottom 0.508: v68.58,10.41 64.52,6.35 60.96,6.35 59.56,4.95 S2.2
N$5
  Top 0.254: U$9.VCAP_2 48.78,69.29 C_VCAP2.2
N$6
  Top 0.61: U$5.- 77.36,69.09 72.14,69.09 71.12,68.07 71.12,66.04 69.85,64.77 R1.2
N$7  (via drill 0.51)
  Top 0.61: R1.1 67.73,65.62 67.31,66.04 v67.42,66.04 | v64.77,68.58 U3.3
  Bottom 0.61: v67.42,66.04 67.31,66.04 v64.77,68.58
N$9
  Top 1.27: D1.+ 20.32,15.46 20.32,16.51 19.56,17.27 19.05,17.27 18.1,18.22 R13.1
N$10
  Top 0.61: U4.3 6.6,58.42 R3.1
N$11
  Top 0.61: U$7.- 57.91,88.39 57.49,87.97 R5.2
N$12
  Top 0.61: R5.1 55.79,85.76 53.34,83.31 U5.3
N$13  (via drill 0.51)
  Top 0.61: v25.4,88.9 25.4,87.63 24.55,86.78 R7.2
  Bottom 0.61: U$8.- 25.4,90.74 v25.4,88.9
N$14
  Top 0.61: R7.1 U6.3
N$18
  Top 0.61: R15.1 D3.2
N$20
  Top 0.61: R16.1 D4.2
N$22
  Top 0.61: R17.1 D5.2
NRST  (via drill 0.51)
  Top 0.254: U$9.NRST 30.47,66.79 29.72,66.04
  Top 0.61: RESET.1 5.64,14.53 6.91,15.8 C_RESET.1 8.19,18.35 8.89,19.05 13.97,19.05 25.65,30.73 25.65,64.26 27.43,66.04 | 27.43,66.04 29.72,66.04 | 27.43,66.04 v27.43,67.56 | v28.19,74.17 30.73,76.71 32.51,76.71 33.02,77.22 v33.02,77.47
  Bottom 0.61: J1.4 35.31,87.38 32.6,87.38 29.21,83.99 29.21,81.28 v33.02,77.47 | v27.43,67.56 27.18,67.82 27.18,73.15 v28.19,74.17
PA0  (via drill 0.51)
  Top 0.254: U$9.PA0_WKUP 32.81,63.29 v32.51,62.99
  Top 0.61: U4.1 7.62,60.96 15.24,60.96 16.09,61.81 R4.2 17.02,62.23 v17.78,62.99
  Bottom 0.61: v32.51,62.99 v17.78,62.99
PA1  (via drill 0.51)
  Top 0.254: v49.02,64.26 47.13,64.26 47.13,64.27 46.41,64.27 U$9.PC6
  Top 0.406: U2.9 45.09,12.06 45.72,12.7 v45.72,12.62
  Bottom 0.406: v45.72,12.62 45.8,12.7 50.8,12.7 61.98,23.88 61.98,61.21 58.93,64.26 v49.02,64.26
PA2  (via drill 0.51, 0.75)
  Top 0.254: 33.78,62.74 33.83,62.79 U$9.PA1
  Top 0.305: 32.51,61.72 33.53,62.74 33.78,62.74
  Top 0.406: U2.2 36.2,12.95 36.73,13.49 36.73,13.87 36.83,13.97 36.83,15.24 v35.56,16.51 | v24.13,57.66 24.13,30.99 v21.34,28.19
  Top 0.508: v27.18,61.72 32.51,61.72
  Bottom 0.406: v27.18,61.72 27.18,60.71 v24.13,57.66 | v35.56,16.51 34.29,17.78 27.94,17.78 21.34,24.38 v21.34,28.19
PA3
  Top 0.254: U$9.PA3 36.69,60.29 36.64,60.34
  Top 0.508: JP5.8 40.64,38.1 38.84,38.1 36.3,40.64 35.56,40.64 32.87,43.33 32.87,56.57 36.64,60.34
PA13  (via drill 0.51)
  Top 0.254: U$9.PA13 46.41,68.77 47.13,68.77 47.32,68.58 47.32,68.5 47.75,68.07
  Top 0.61: v52.07,68.58 51.56,68.07 47.75,68.07
  Top 0.762: J1.3 45.72,95.25 62.23,95.25 69.85,87.63 69.85,83.82 v67.31,81.28
  Bottom 0.762: v67.31,81.28 67.31,80.01 55.88,68.58 v52.07,68.58
PA14  (via drill 0.51)
  Top 0.254: U$9.PA14 44.39,73.09 44.45,73.15
  Top 0.61: v47.5,77.72 47.5,76.2 44.45,73.15
  Bottom 0.61: J1.1 44.45,86.36 48.01,82.8 48.01,78.23 v47.5,77.72
PB0  (via drill 0.51)
  Top 0.254: U$9.PB0 41.4,60.28 41.4,59.44 41.15,59.18 40.64,59.18 v40.39,58.93
  Top 0.508: JP5.3 37.39,41.91 34.85,44.45 34.85,47.55 35.56,48.26 38.1,48.26 38.86,47.5 43.94,47.5 v44.45,46.99
  Bottom 0.508: v44.45,46.99 46.99,49.53 46.99,50.8 40.39,57.4 v40.39,58.93
PB1  (via drill 0.51)
  Top 0.254: U$9.PB1 41.91,60.27 41.91,59.55 | 41.91,59.55 | 41.91,59.55 v41.91,57.91
  Top 0.508: v59.44,55.63 59.86,55.63 66.46,62.23 66.46,67.31 R11.2
  Top 0.61: U$15.E 68.95,72.76 67.31,71.12 67.31,69 R11.2
  Bottom 0.508: v41.91,57.91 46.99,57.91 49.28,55.63 v59.44,55.63
PB2
  Top 0.254: U$9.PB2 42.39,59.21 42.42,59.18 43.18,58.42
  Top 0.508: R_B1.1 43.18,57.24 43.18,58.42
PB3
  Top 0.254: 41.4,73.66 41.4,72.9 41.4,71.8 U$9.PB3
  Top 0.61: R16.2 42.25,77.47 42.67,77.05 42.67,75.69 41.4,74.42 41.4,73.66
PB4
  Top 0.254: U$9.PB4 40.89,73.27 40.77,73.4 40.77,74.8 40.64,74.93
  Top 0.61: R17.2 37.68,76.2 39.37,76.2 40.64,74.93
PB5  (via drill 0.51)
  Top 0.254: v39.62,73.66 39.37,73.41 39.37,72.9 39.55,72.72 40.18,72.72 40.37,72.53 40.37,71.81 U$9.PB5
  Top 0.61: R6.2 52.07,78.99 U5.1 v54.61,76.71
  Bottom 0.61: v54.61,76.71 51.56,73.66 v39.62,73.66
PB7  (via drill 0.51)
  Top 0.254: U$9.PB7 39.37,71.77 39.37,70.8
  Top 0.61: U6.1 31.5,83.57 v30.48,82.55 30.06,82.55 R8.2 | 39.37,70.8 39.12,70.55 39.12,70.36 v37.85,69.09
  Bottom 0.61: v30.48,82.55 35.56,77.47 35.56,71.37 v37.85,69.09
PB11  (via drill 0.51)
  Top 0.254: 43.39,59.21 U$9.PB11
  Top 0.406: v47.75,55.37 47.23,55.37 43.39,59.21
  Bottom 0.406: JP5.5 40.69,40.69 40.69,42.41 41.41,43.13 42.31,43.13 48.26,49.08 48.26,54.86 v47.75,55.37
PB13  (via drill 0.51)
  Top 0.254: v47.7,62.48 47.7,62.7 47.09,63.31 46.41,63.31 U$9.PB14
  Top 0.61: U3.1 63.25,65.87 R2.2 63.08,65.62 v58.41,60.95
  Bottom 0.61: v58.41,60.95 48.27,60.95 47.75,61.47 47.75,62.48 v47.7,62.48
PB14
  Top 0.254: U$9.PA2 34.35,62.29 34.29,62.23
  Top 0.406: U2.19 36.2,22.47 27.69,30.98 27.69,59.18 28.19,59.69 31.56,59.69 34.1,62.23 34.29,62.23
PB15  (via drill 0.51)
  Top 0.254: 48.26,63.5 47.97,63.79 U$9.PB15
  Top 0.406: U2.12 45.09,34.92 v45.72,35.56 | v50.8,62.23 49.53,62.23 48.26,63.5
  Bottom 0.406: v45.72,35.56 54.61,35.56 60.71,41.66 60.71,59.94 58.42,62.23 v50.8,62.23
PC0  (via drill 0.51)
  Top 0.254: v37.08,66.8 36.83,67.06 36.32,67.06 35.82,66.55 35.82,66.5 35.63,66.31 34.91,66.31 U$9.PC0
  Top 0.61: U$4.E 58.57,83.82 58,83.82 R12.2 v58.42,82.55
  Bottom 0.61: v58.42,82.55 58.42,78.74 52.07,72.39 46.99,72.39 43.69,69.09 41.66,69.09 39.37,66.8 v37.08,66.8
PC1  (via drill 0.51)
  Top 0.254: v36.48,65.69 35.71,65.69 35.63,65.77 34.91,65.77 U$9.PC1
  Top 0.61: U$18.E 21.92,82.04 R10.2 25.24,81.35 25.24,81.28 26.01,80.52 v26.16,80.52
  Bottom 0.61: v26.16,80.52 28.19,80.52 32.77,75.95 33.53,75.95 34.54,74.93 34.54,70.36 36.07,68.83 36.07,66.38 36.48,65.97 v36.48,65.69
PC2  (via drill 0.51)
  Top 0.254: v33.27,65.79 33.77,65.29 U$9.PC2
  Top 0.61: v19.81,66.04 R9.2 16.09,67.73 v15.24,68.58
  Bottom 0.61: v19.81,66.04 27.52,66.04 27.77,65.79 v33.27,65.79 | v15.24,68.58 9.87,73.95 U$19.E
PC4  (via drill 0.51)
  Top 0.254: 40.44,62.18 40.44,61.05 40.41,61.03 40.41,60.31 U$9.PC4
  Top 0.406: v40.13,62.48 40.44,62.18
  Top 0.508: JP5.10 41.4,34.29 40.13,35.56 35.03,35.56 30.48,40.11 30.48,56.9 v31.75,58.17
  Bottom 0.406: v31.75,58.17 33.27,59.69 33.53,59.69 36.58,62.74 39.88,62.74 v40.13,62.48
PC12
  Top 0.254: 42.42,72.9 42.42,72.53 42.41,72.53 42.41,71.81 U$9.PC12
  Top 0.61: R15.2 43.85,75.1 42.42,73.66 42.42,72.9
VCAP_1
  Top 0.254: U$9.VCAP_1 43.91,60.27 43.91,59.45 44.57,58.79 44.82,58.79 44.96,58.93
  Top 0.508: 44.96,58.93 45.72,59.69 45.72,60.2 46.22,60.7 C_VCAP1.2